# Altium schematic sheet Scaner motherbord.SchDoc
size A4
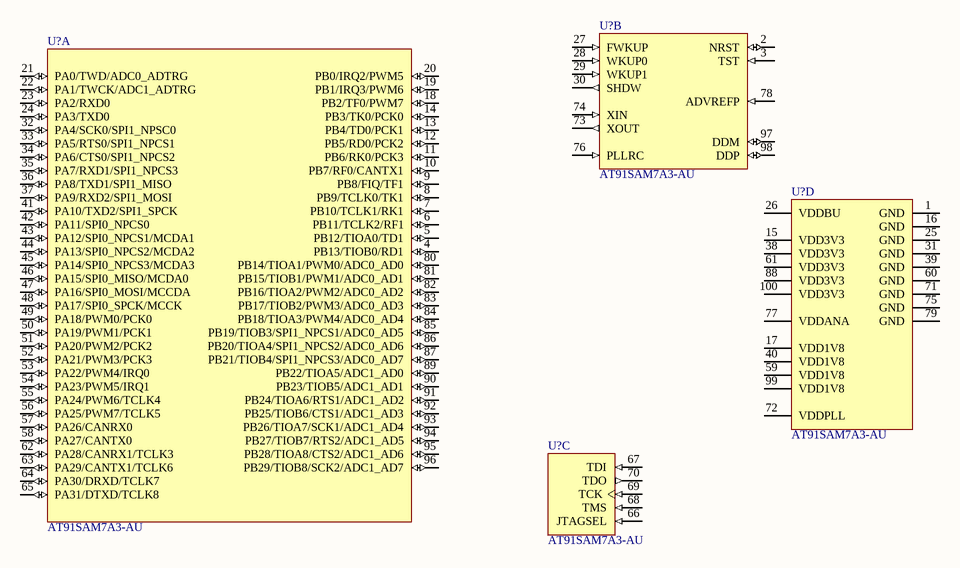
[diagram p0: Scaner motherbord.SchDoc]

## Parts
(Parts that share a designator on the sheet are numbered #1, #2 ... from top to bottom, then left to right.)
U?#1  AT91SAM7A3-AU  [LQFP100_N]  (part B of 4)
U?#2  AT91SAM7A3-AU  [LQFP100_N]  (part A of 4)
U?#3  AT91SAM7A3-AU  [LQFP100_N]  (part D of 4)
U?#4  AT91SAM7A3-AU  [LQFP100_N]  (part C of 4)

## Nets

Not connected (* = marked no-connect by the designer): U?#1 2(NRST) 3(TST) 27(FWKUP) 28(WKUP0) 29(WKUP1) 30(SHDW) 73(XOUT) 74(XIN) 76(PLLRC) 78(ADVREFP) 97(DDM) 98(DDP); U?#2 4(PB13/TIOB0/RD1) 5(PB12/TIOA0/TD1) 6(PB11/TCLK2/RF1) 7(PB10/TCLK1/RK1) 8(PB9/TCLK0/TK1) 9(PB8/FIQ/TF1) 10(PB7/RF0/CANTX1) 11(PB6/RK0/PCK3) 12(PB5/RD0/PCK2) 13(PB4/TD0/PCK1) 14(PB3/TK0/PCK0) 18(PB2/TF0/PWM7) 19(PB1/IRQ3/PWM6) 20(PB0/IRQ2/PWM5) 21(PA0/TWD/ADC0_ADTRG) 22(PA1/TWCK/ADC1_ADTRG) 23(PA2/RXD0) 24(PA3/TXD0) 32(PA4/SCK0/SPI1_NPSC0) 33(PA5/RTS0/SPI1_NPCS1) 34(PA6/CTS0/SPI1_NPCS2) 35(PA7/RXD1/SPI1_NPCS3) 36(PA8/TXD1/SPI1_MISO) 37(PA9/RXD2/SPI1_MOSI) 41(PA10/TXD2/SPI1_SPCK) 42(PA11/SPI0_NPCS0) 43(PA12/SPI0_NPCS1/MCDA1) 44(PA13/SPI0_NPCS2/MCDA2) 45(PA14/SPI0_NPCS3/MCDA3) 46(PA15/SPI0_MISO/MCDA0) 47(PA16/SPI0_MOSI/MCCDA) 48(PA17/SPI0_SPCK/MCCK) 49(PA18/PWM0/PCK0) 50(PA19/PWM1/PCK1) 51(PA20/PWM2/PCK2) 52(PA21/PWM3/PCK3) 53(PA22/PWM4/IRQ0) 54(PA23/PWM5/IRQ1) 55(PA24/PWM6/TCLK4) 56(PA25/PWM7/TCLK5) 57(PA26/CANRX0) 58(PA27/CANTX0) 62(PA28/CANRX1/TCLK3) 63(PA29/CANTX1/TCLK6) 64(PA30/DRXD/TCLK7) 65(PA31/DTXD/TCLK8) 80(PB14/TIOA1/PWM0/ADC0_AD0) 81(PB15/TIOB1/PWM1/ADC0_AD1) 82(PB16/TIOA2/PWM2/ADC0_AD2) 83(PB17/TIOB2/PWM3/ADC0_AD3) 84(PB18/TIOA3/PWM4/ADC0_AD4) 85(PB19/TIOB3/SPI1_NPCS1/ADC0_AD5) 86(PB20/TIOA4/SPI1_NPCS2/ADC0_AD6) 87(PB21/TIOB4/SPI1_NPCS3/ADC0_AD7) 89(PB22/TIOA5/ADC1_AD0) 90(PB23/TIOB5/ADC1_AD1) 91(PB24/TIOA6/RTS1/ADC1_AD2) 92(PB25/TIOB6/CTS1/ADC1_AD3) 93(PB26/TIOA7/SCK1/ADC1_AD4) 94(PB27/TIOB7/RTS2/ADC1_AD5) 95(PB28/TIOA8/CTS2/ADC1_AD6) 96(PB29/TIOB8/SCK2/ADC1_AD7); U?#3 1(GND) 15(VDD3V3) 16(GND) 17(VDD1V8) 25(GND) 26(VDDBU) 31(GND) 38(VDD3V3) 39(GND) 40(VDD1V8) 59(VDD1V8) 60(GND) 61(VDD3V3) 71(GND) 72(VDDPLL) 75(GND) 77(VDDANA) 79(GND) 88(VDD3V3) 99(VDD1V8) 100(VDD3V3); U?#4 66(JTAGSEL) 67(TDI) 68(TMS) 69(TCK) 70(TDO)

## Library data of the parts
U?#1-U?#4 = AT91SAM7A3-AU: AT91 ARM Thumb-based 32-bit Microcontroller, 256KB Flash, 32KB SRAM, 2CAN, 100-Pin LQFP, Industrial Grade (-40°C to 85°C), Pb-Free; Published: 16-Oct-2006; DatasheetVersion: revE, Dec-2006; PackageVersion: Apr-2006; PackageReference: LQFP100; Publisher: Altium Limited; PackageDescription: 100-Pin Thin Quad Flat Pack 0.5 mm Pitch; Supplier 1: Digi-Key; Supplier Part Number 1: AT91SAM7A3-AU-ND; Supplier 2: Farnell; Supplier Part Number 2: 1455079; Supplier 3: Mouser; Supplier Part Number 3: 556-A91SAM7A3AU; Code_JEDEC: MS-026-BED; ComponentLink1Description: Manufacturer Link; ComponentLink1URL: http://www.atmel.com/products/AT91/default.asp?; ComponentLink2Description: AT91SAM7A3 Datasheet; ComponentLink2URL: http://www.atmel.com/dyn/resources/prod_documents/doc6042.pdf; ComponentLink3Description: AT91SAM7A3 Summary; ComponentLink3URL: http://www.atmel.com/dyn/resources/prod_documents/6042s.pdf; ComponentLink4Description: ARM7TDMI Reference Manual; ComponentLink4URL: http://www.atmel.com/dyn/resources/prod_documents/DDI0029G_7TDMI_R3_trm.pdf; ComponentLink5Description: Atmel.com Home; ComponentLink5URL: http://www.atmel.com